# EAGLE schematic Reach_B0 (EAGLE 8.4.2)

## Sheet 1 of 5: A&B Stepper drivers
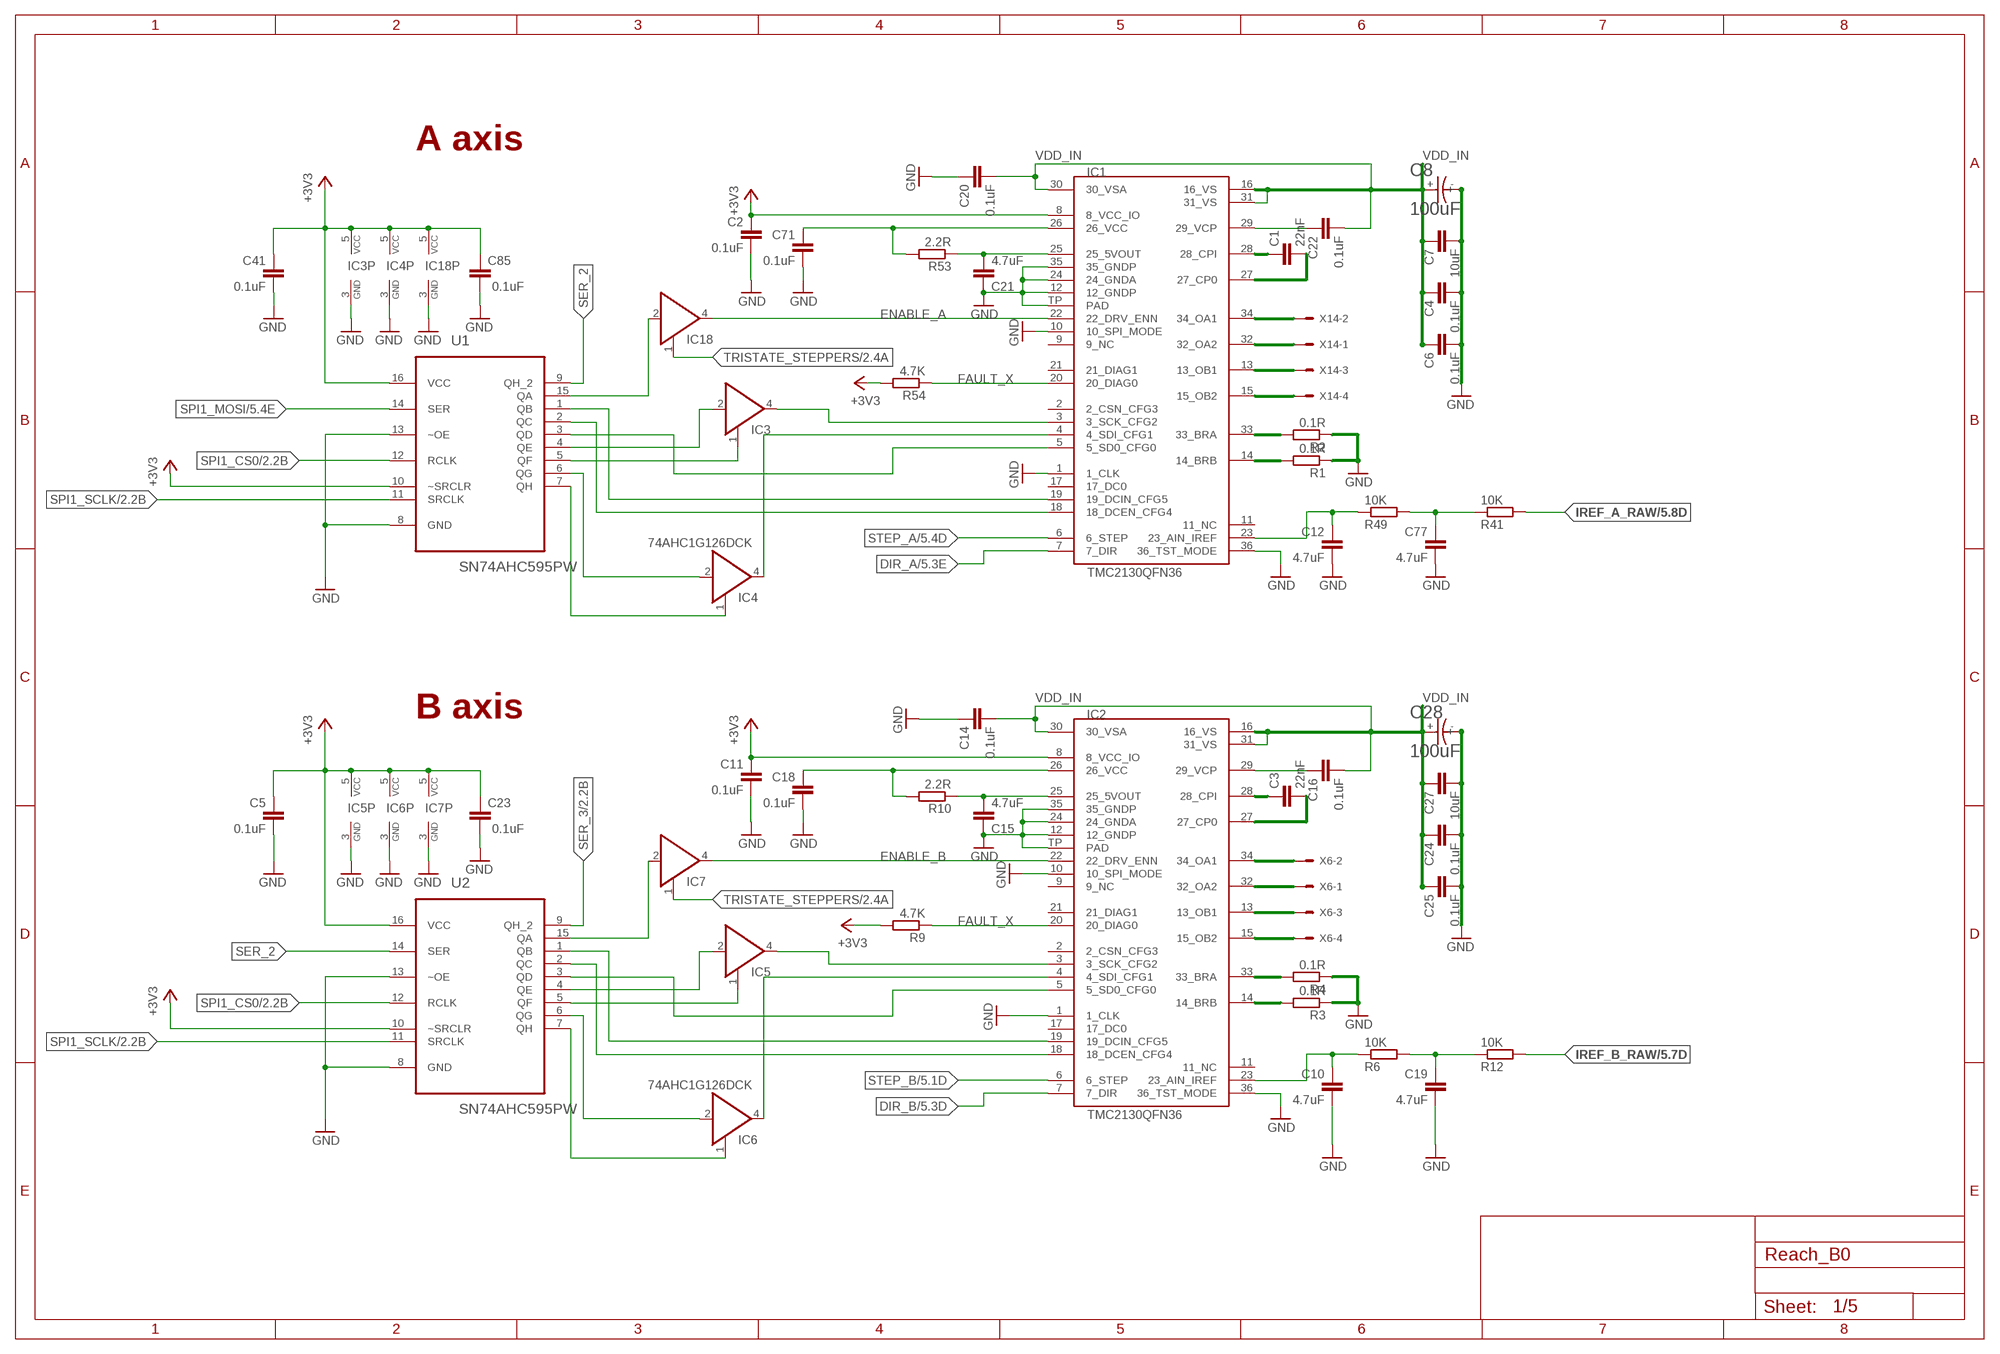
[diagram p0: schematic, sheet 1]

### Parts
C1  22nF  C-EUC0402  [C0402]
C2  0.1uF  C-EUC0402  [C0402]
C3  22nF  C-EUC0402  [C0402]
C4  0.1uF  C-EUC0402  [C0402]
C5  0.1uF  C-EUC0402  [C0402]
C6  0.1uF  C-EUC0402  [C0402]
C7  10uF  C-EUC0805  [C0805]
C8  100uF  C  [RHS1V10MCN1GS]
C10  4.7uF  C-EUC0402  [C0402]
C11  0.1uF  C-EUC0402  [C0402]
C12  4.7uF  C-EUC0402  [C0402]
C14  0.1uF  C-EUC0402  [C0402]
C15  4.7uF  C-EUC0402  [C0402]
C16  0.1uF  C-EUC0402  [C0402]
C18  0.1uF  C-EUC0402  [C0402]
C19  4.7uF  C-EUC0402  [C0402]
C20  0.1uF  C-EUC0402  [C0402]
C21  4.7uF  C-EUC0402  [C0402]
C22  0.1uF  C-EUC0402  [C0402]
C23  0.1uF  C-EUC0402  [C0402]
C24  0.1uF  C-EUC0402  [C0402]
C25  0.1uF  C-EUC0402  [C0402]
C27  10uF  C-EUC0805  [C0805]
C28  100uF  C  [RHS1V10MCN1GS]
C41  0.1uF  C-EUC0402  [C0402]
C71  0.1uF  C-EUC0402  [C0402]
C77  4.7uF  C-EUC0402  [C0402]
C85  0.1uF  C-EUC0402  [C0402]
IC1  TMC2130QFN36  [QFN36]
IC2  TMC2130QFN36  [QFN36]
IC3  74AHC1G126DCK  [SC70-5]
IC4  74AHC1G126DCK  [SC70-5]
IC5  74AHC1G126DCK  [SC70-5]
IC6  74AHC1G126DCK  [SC70-5]
IC7  74AHC1G126DCK  [SC70-5]
IC18  74AHC1G126DCK  [SC70-5]
R1  0.1R  R-EU_R0805  [R0805]
R2  0.1R  R-EU_R0805  [R0805]
R3  0.1R  R-EU_R0805  [R0805]
R4  0.1R  R-EU_R0805  [R0805]
R6  10K  R-EU_R0402  [R0402]
R9  4.7K  R-EU_R0402  [R0402]
R10  2.2R  R-EU_R0402  [R0402]
R12  10K  R-EU_R0402  [R0402]
R41  10K  R-EU_R0402  [R0402]
R49  10K  R-EU_R0402  [R0402]
R53  2.2R  R-EU_R0402  [R0402]
R54  4.7K  R-EU_R0402  [R0402]
U1  SN74AHC595PW  [SOP65P640X120-16N]
U2  SN74AHC595PW  [SOP65P640X120-16N]
X6  22-05-7048-04  [7395-04]
X14  22-05-7048-04  [7395-04]

### Nets
+3V3: C2.1 C5.1 C11.1 C23.1 C41.1 C85.1 IC1.8(8_VCC_IO) IC2.8(8_VCC_IO) IC3.5(VCC) IC4.5(VCC) IC5.5(VCC) IC6.5(VCC) IC7.5(VCC) IC18.5(VCC) R9.2 R54.2 U1.10(~SRCLR) U1.16(VCC) U2.10(~SRCLR) U2.16(VCC) ; also sheet 2,4,5
B_A3: IC2.34(34_OA1) X6.2
B_A4: IC2.32(32_OA2) X6.1
B_B3: IC2.15(15_OB2) X6.4
B_B4: IC2.13(13_OB1) X6.3
DIR_A: IC1.7(7_DIR) ; also sheet 5
DIR_B: IC2.7(7_DIR) ; also sheet 5
ENABLE_A: IC1.22(22_DRV_ENN) IC18.4(O)
ENABLE_B: IC2.22(22_DRV_ENN) IC7.4(O)
FAULT_X: IC1.20(20_DIAG0) IC2.20(20_DIAG0) R9.1 R54.1 ; also sheet 2,5
GND: C2.2 C4.2 C5.2 C6.2 C7.2 C8.- C10.2 C11.2 C12.2 C14.1 C15.1 C18.2 C19.2 C20.1 C21.1 C23.2 C24.2 C25.2 C27.2 C28.- C41.2 C71.2 C77.2 C85.2 IC1.1(1_CLK) IC1.10(10_SPI_MODE) IC1.12(12_GNDP) IC1.24(24_GNDA) IC1.35(35_GNDP) IC1.36(36_TST_MODE) IC1.TP(PAD) IC2.1(1_CLK) IC2.10(10_SPI_MODE) IC2.12(12_GNDP) IC2.24(24_GNDA) IC2.35(35_GNDP) IC2.36(36_TST_MODE) IC2.TP(PAD) IC3.3(GND) IC4.3(GND) IC5.3(GND) IC6.3(GND) IC7.3(GND) IC18.3(GND) R1.1 R2.1 R3.1 R4.1 U1.8(GND) U1.13(~OE) U2.8(GND) U2.13(~OE) ; also sheet 2,3,4,5
IREF_A: C77.1 R41.1 R49.2
IREF_A_RAW: R41.2 ; also sheet 5
IREF_B: C19.1 R6.2 R12.1
IREF_B_RAW: R12.2 ; also sheet 5
N$1: C3.2 IC2.27(27_CP0)
N$2: IC2.14(14_BRB) R3.2
N$3: IC2.33(33_BRA) R4.2
N$4: IC4.1(OE) U1.7(QH)
N$5: IC4.2(I) U1.6(QG)
N$6: IC1.18(18_DCEN_CFG4) U1.2(QC)
N$16: C1.1 IC1.28(28_CPI)
N$17: C1.2 IC1.27(27_CP0)
N$18: IC1.14(14_BRB) R1.2
N$19: IC1.33(33_BRA) R2.2
N$20: C12.1 IC1.23(23_AIN_IREF) R49.1
N$22: C10.1 IC2.23(23_AIN_IREF) R6.1
N$23: C3.1 IC2.28(28_CPI)
N$24: C15.2 IC2.25(25_5VOUT) R10.1
N$25: C16.1 IC2.29(29_VCP)
N$26: IC2.18(18_DCEN_CFG4) U2.2(QC)
N$27: IC2.19(19_DCIN_CFG5) U2.1(QB)
N$28: IC6.1(OE) U2.7(QH)
N$29: IC6.2(I) U2.6(QG)
N$30: IC5.2(I) U2.4(QE)
N$31: C21.2 IC1.25(25_5VOUT) R53.1
N$32: IC5.1(OE) U2.5(QF)
N$33: C22.1 IC1.29(29_VCP)
N$34: IC3.2(I) U1.4(QE)
N$35: IC2.5(5_SD0_CFG0) U2.3(QD)
N$36: C18.1 IC2.26(26_VCC) R10.2
N$37: IC7.2(I) U2.15(QA)
N$40: IC3.1(OE) U1.5(QF)
N$43: IC1.19(19_DCIN_CFG5) U1.1(QB)
N$44: IC1.5(5_SD0_CFG0) U1.3(QD)
N$108: C71.1 IC1.26(26_VCC) R53.2
N$120: IC18.2(I) U1.15(QA)
SER_2: U1.9(QH_2) U2.14(SER)
SER_3: U2.9(QH_2) ; also sheet 2
SPI1_CS0: U1.12(RCLK) U2.12(RCLK) ; also sheet 2,5
SPI1_MOSI: U1.14(SER) ; also sheet 5
SPI1_SCLK: U1.11(SRCLK) U2.11(SRCLK) ; also sheet 2,5
STEP_A: IC1.6(6_STEP) ; also sheet 5
STEP_B: IC2.6(6_STEP) ; also sheet 5
TRISTATE_STEPPERS: IC7.1(OE) IC18.1(OE) ; also sheet 2
VDD_IN: C4.1 C6.1 C7.1 C8.+ C14.2 C16.2 C20.2 C22.2 C24.1 C25.1 C27.1 C28.+ IC1.16(16_VS) IC1.30(30_VSA) IC1.31(31_VS) IC2.16(16_VS) IC2.30(30_VSA) IC2.31(31_VS) ; also sheet 2,3
X_A1: IC1.34(34_OA1) X14.2
X_A2: IC1.32(32_OA2) X14.1
X_B1: IC1.13(13_OB1) X14.3
X_B2: IC1.15(15_OB2) X14.4
X_CFG1: IC1.4(4_SDI_CFG1) IC4.4(O)
X_CFG2: IC1.3(3_SCK_CFG2) IC3.4(O)
X_CFG3: IC2.3(3_SCK_CFG2) IC5.4(O)
X_CFG4: IC2.4(4_SDI_CFG1) IC6.4(O)
Unconnected: IC1.2(2_CSN_CFG3) IC1.9(9_NC) IC1.11(11_NC) IC1.17(17_DC0) IC1.21(21_DIAG1) IC2.2(2_CSN_CFG3) IC2.9(9_NC) IC2.11(11_NC) IC2.17(17_DC0) IC2.21(21_DIAG1)

### Notes on the sheet
- A axis
- B axis

## Sheet 2 of 5: C Stepper driver
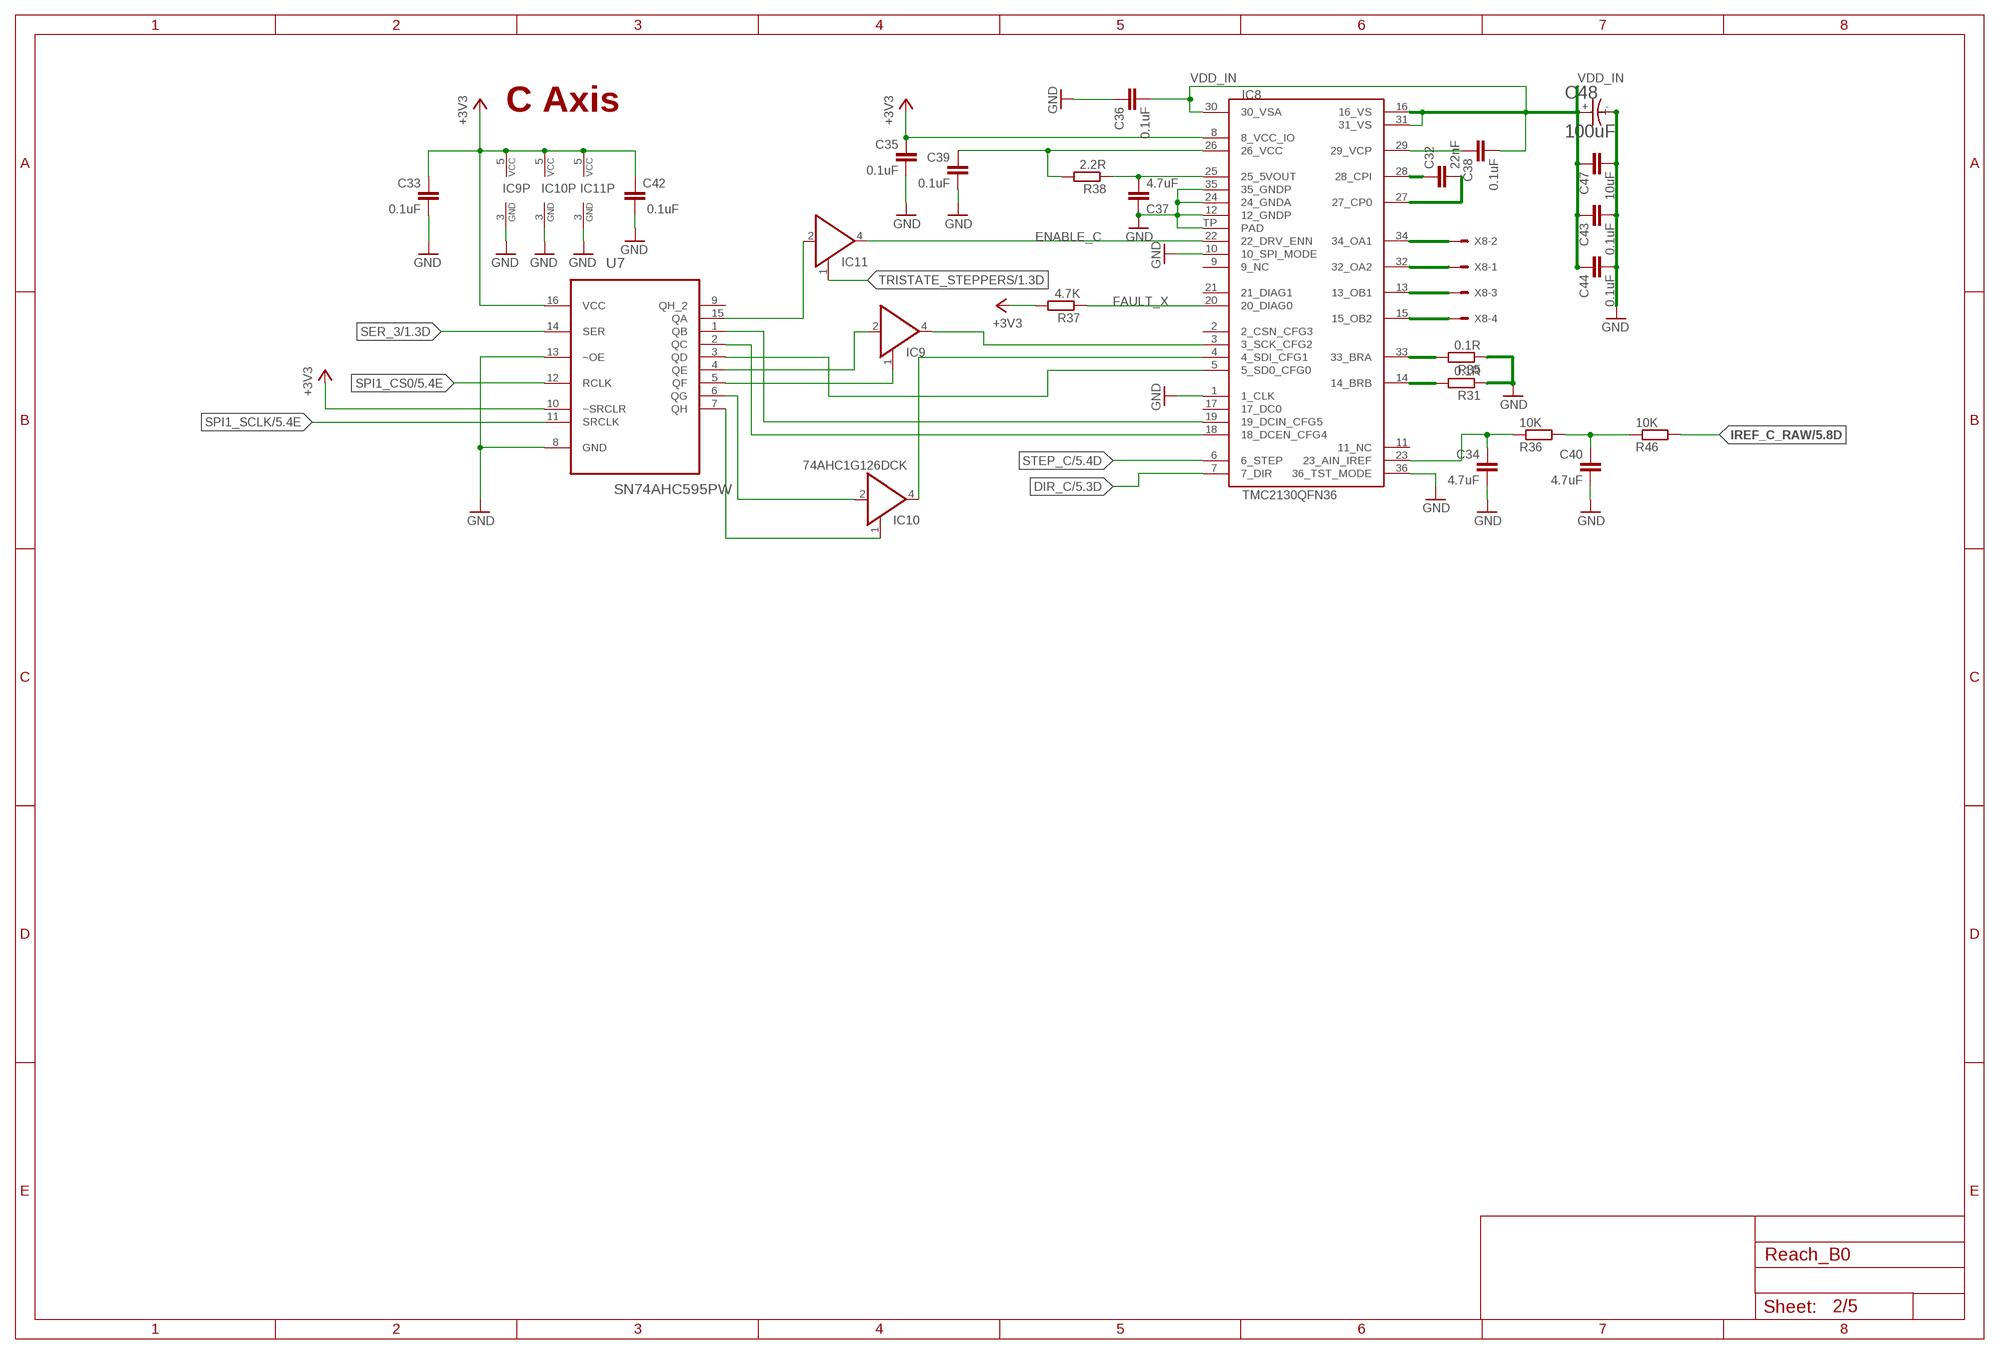
[diagram p1: schematic, sheet 2]

### Parts
C32  22nF  C-EUC0402  [C0402]
C33  0.1uF  C-EUC0402  [C0402]
C34  4.7uF  C-EUC0402  [C0402]
C35  0.1uF  C-EUC0402  [C0402]
C36  0.1uF  C-EUC0402  [C0402]
C37  4.7uF  C-EUC0402  [C0402]
C38  0.1uF  C-EUC0402  [C0402]
C39  0.1uF  C-EUC0402  [C0402]
C40  4.7uF  C-EUC0402  [C0402]
C42  0.1uF  C-EUC0402  [C0402]
C43  0.1uF  C-EUC0402  [C0402]
C44  0.1uF  C-EUC0402  [C0402]
C47  10uF  C-EUC0805  [C0805]
C48  100uF  C  [RHS1V10MCN1GS]
IC8  TMC2130QFN36  [QFN36]
IC9  74AHC1G126DCK  [SC70-5]
IC10  74AHC1G126DCK  [SC70-5]
IC11  74AHC1G126DCK  [SC70-5]
R31  0.1R  R-EU_R0805  [R0805]
R35  0.1R  R-EU_R0805  [R0805]
R36  10K  R-EU_R0402  [R0402]
R37  4.7K  R-EU_R0402  [R0402]
R38  2.2R  R-EU_R0402  [R0402]
R46  10K  R-EU_R0402  [R0402]
U7  SN74AHC595PW  [SOP65P640X120-16N]
X8  22-05-7048-04  [7395-04]

### Nets
+3V3: C33.1 C35.1 C42.1 IC8.8(8_VCC_IO) IC9.5(VCC) IC10.5(VCC) IC11.5(VCC) R37.2 U7.10(~SRCLR) U7.16(VCC) ; also sheet 1,4,5
C_A3: IC8.34(34_OA1) X8.2
C_A4: IC8.32(32_OA2) X8.1
C_B3: IC8.15(15_OB2) X8.4
C_B4: IC8.13(13_OB1) X8.3
DIR_C: IC8.7(7_DIR) ; also sheet 5
ENABLE_C: IC8.22(22_DRV_ENN) IC11.4(O)
FAULT_X: IC8.20(20_DIAG0) R37.1 ; also sheet 1,5
GND: C33.2 C34.2 C35.2 C36.1 C37.1 C39.2 C40.2 C42.2 C43.2 C44.2 C47.2 C48.- IC8.1(1_CLK) IC8.10(10_SPI_MODE) IC8.12(12_GNDP) IC8.24(24_GNDA) IC8.35(35_GNDP) IC8.36(36_TST_MODE) IC8.TP(PAD) IC9.3(GND) IC10.3(GND) IC11.3(GND) R31.1 R35.1 U7.8(GND) U7.13(~OE) ; also sheet 1,3,4,5
IREF_C: C40.1 R36.2 R46.1
IREF_C_RAW: R46.2 ; also sheet 5
N$52: C32.2 IC8.27(27_CP0)
N$54: IC8.14(14_BRB) R31.2
N$55: IC8.33(33_BRA) R35.2
N$56: C34.1 IC8.23(23_AIN_IREF) R36.1
N$57: C32.1 IC8.28(28_CPI)
N$58: C37.2 IC8.25(25_5VOUT) R38.1
N$59: C38.1 IC8.29(29_VCP)
N$60: IC8.18(18_DCEN_CFG4) U7.2(QC)
N$61: IC8.19(19_DCIN_CFG5) U7.1(QB)
N$62: IC10.1(OE) U7.7(QH)
N$63: IC10.2(I) U7.6(QG)
N$65: IC9.2(I) U7.4(QE)
N$66: IC9.1(OE) U7.5(QF)
N$67: IC8.5(5_SD0_CFG0) U7.3(QD)
N$68: C39.1 IC8.26(26_VCC) R38.2
N$69: IC11.2(I) U7.15(QA)
SER_3: U7.14(SER) ; also sheet 1
SPI1_CS0: U7.12(RCLK) ; also sheet 1,5
SPI1_SCLK: U7.11(SRCLK) ; also sheet 1,5
STEP_C: IC8.6(6_STEP) ; also sheet 5
TRISTATE_STEPPERS: IC11.1(OE) ; also sheet 1
VDD_IN: C36.2 C38.2 C43.1 C44.1 C47.1 C48.+ IC8.16(16_VS) IC8.30(30_VSA) IC8.31(31_VS) ; also sheet 1,3
X_CFG5: IC8.3(3_SCK_CFG2) IC9.4(O)
X_CFG6: IC8.4(4_SDI_CFG1) IC10.4(O)
Unconnected: IC8.2(2_CSN_CFG3) IC8.9(9_NC) IC8.11(11_NC) IC8.17(17_DC0) IC8.21(21_DIAG1) U7.9(QH_2)

### Notes on the sheet
- C Axis

## Sheet 3 of 5: Supply and power electronics
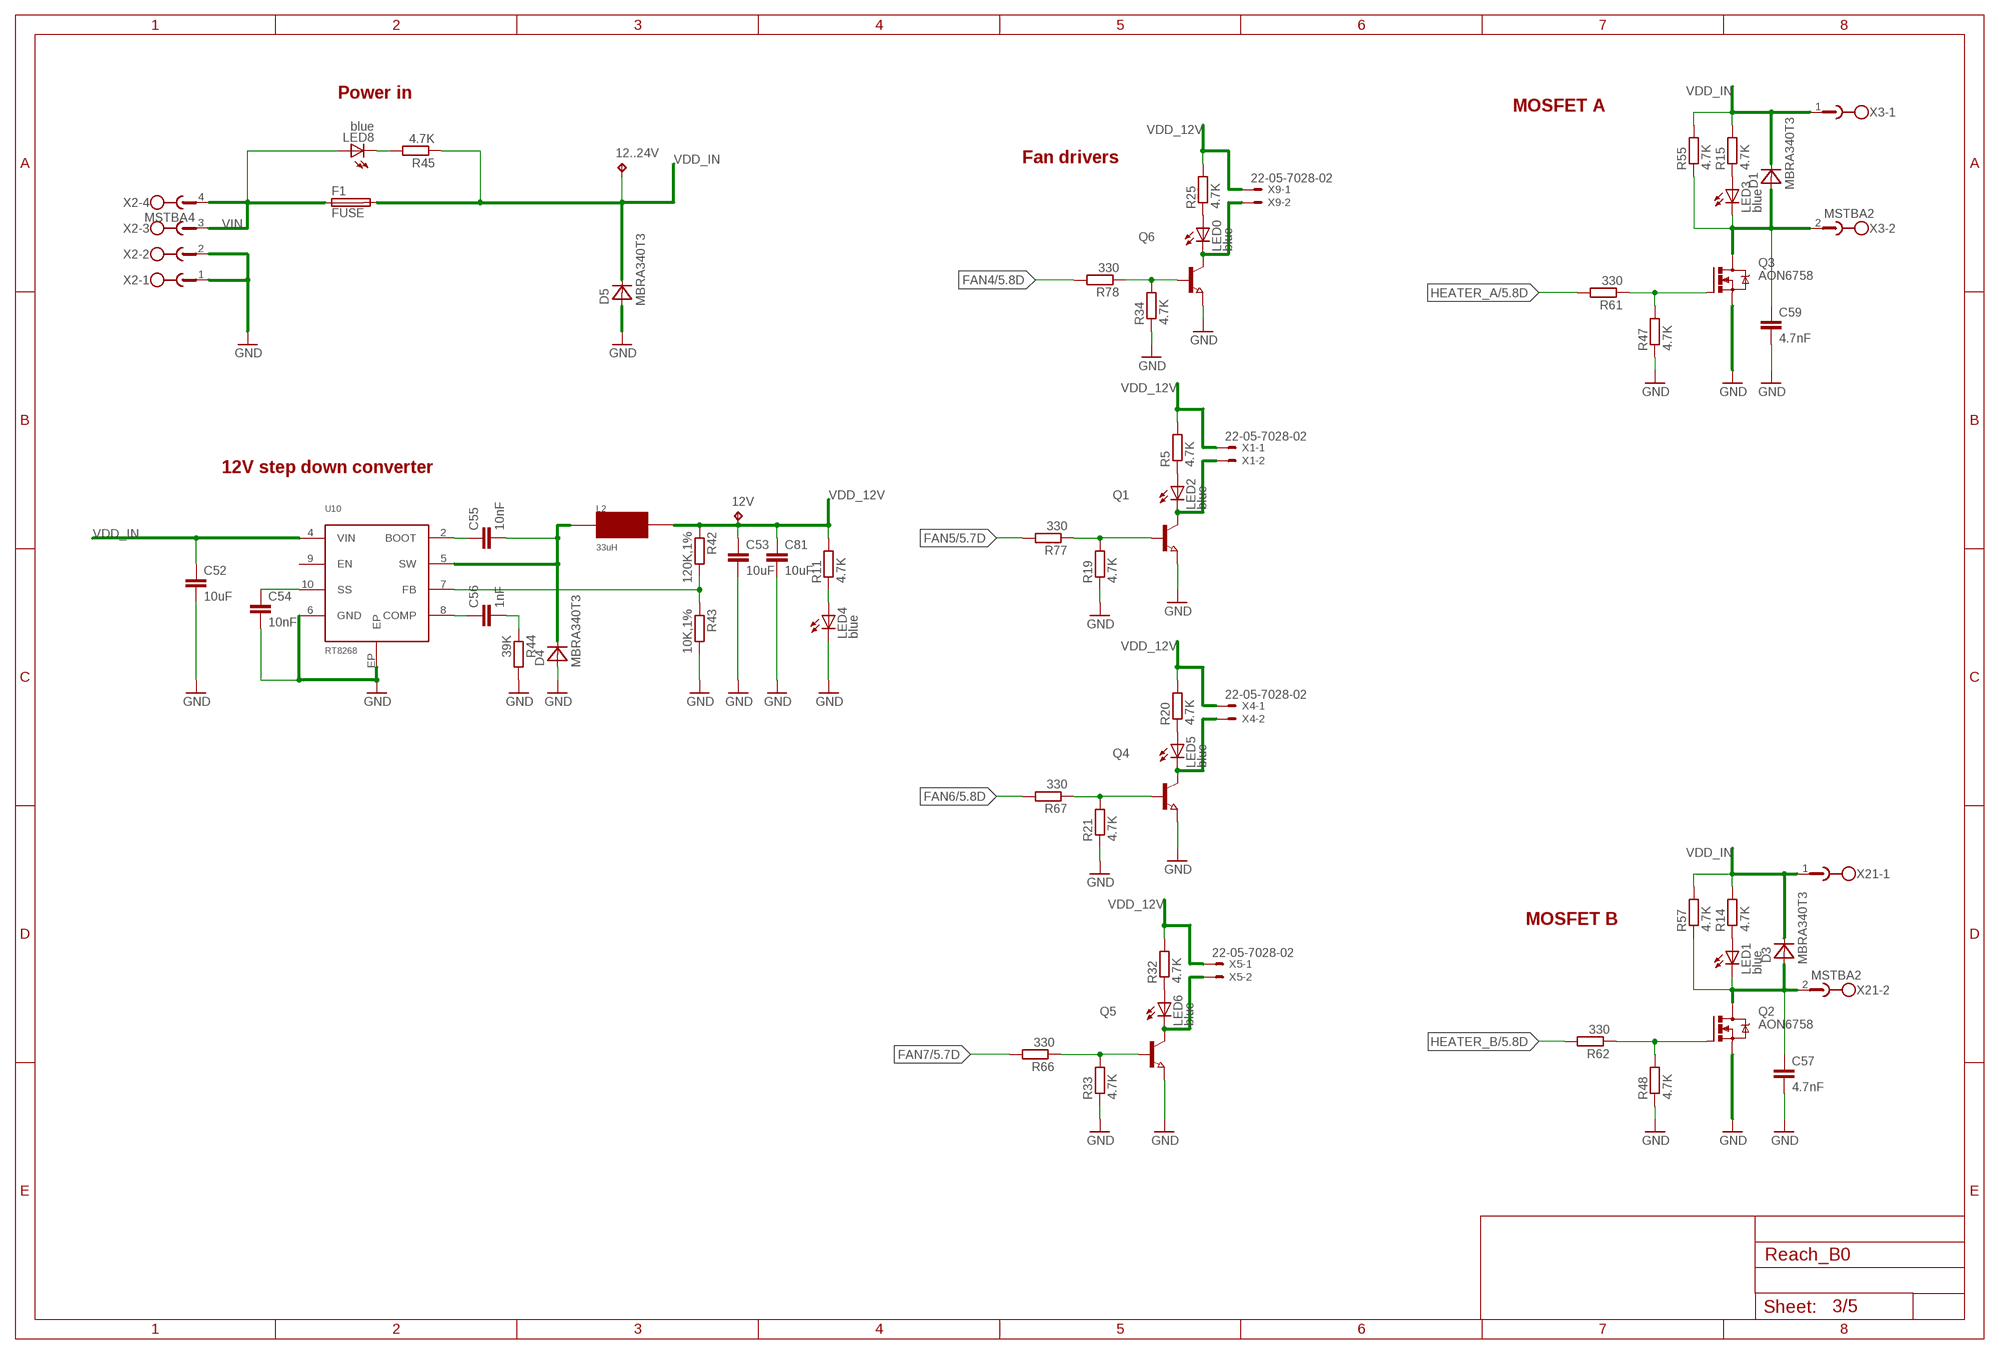
[diagram p2: schematic, sheet 3]

### Parts
12..24V  TPB1,27  [B1,27]
12V  TPB1,27  [B1,27]
C52  10uF  C-EUC1206  [C1206]
C53  10uF  C-EUC1206  [C1206]
C54  10nF  C-EUC0402  [C0402]
C55  10nF  C-EUC0402  [C0402]
C56  1nF  C-EUC0402  [C0402]
C57  4.7nF  C-EUC0402  [C0402]
C59  4.7nF  C-EUC0402  [C0402]
C81  10uF  C-EUC1206  [C1206]
D1  MBRA340T3  [SMA]
D3  MBRA340T3  [SMA]
D4  MBRA340T3  [SMA]
D5  MBRA340T3  [SMA]
F1  FUSE  [3557]
L2  33uH  RT8040T330  [NR8040T330]
LED0  blue  LEDCHIP-LED0603  [CHIP-LED0603]
LED1  blue  LEDCHIP-LED0603  [CHIP-LED0603]
LED2  blue  LEDCHIP-LED0603  [CHIP-LED0603]
LED3  blue  LEDCHIP-LED0603  [CHIP-LED0603]
LED4  blue  LEDCHIP-LED0603  [CHIP-LED0603]
LED5  blue  LEDCHIP-LED0603  [CHIP-LED0603]
LED6  blue  LEDCHIP-LED0603  [CHIP-LED0603]
LED8  blue  LEDCHIP-LED0603  [CHIP-LED0603]
Q1  NPN-TRANSISTOR_SOT23  [SOT23]
Q2  AON6758  [8-DFN-EP-(5X6)]
Q3  AON6758  [8-DFN-EP-(5X6)]
Q4  NPN-TRANSISTOR_SOT23  [SOT23]
Q5  NPN-TRANSISTOR_SOT23  [SOT23]
Q6  NPN-TRANSISTOR_SOT23  [SOT23]
R5  4.7K  R-EU_R0402  [R0402]
R11  4.7K  R-EU_R0402  [R0402]
R14  4.7K  R-EU_R0402  [R0402]
R15  4.7K  R-EU_R0402  [R0402]
R19  4.7K  R-EU_R0402  [R0402]
R20  4.7K  R-EU_R0402  [R0402]
R21  4.7K  R-EU_R0402  [R0402]
R25  4.7K  R-EU_R0402  [R0402]
R32  4.7K  R-EU_R0402  [R0402]
R33  4.7K  R-EU_R0402  [R0402]
R34  4.7K  R-EU_R0402  [R0402]
R42  120K,1%  R-EU_R0402  [R0402]
R43  10K,1%  R-EU_R0402  [R0402]
R44  39K  R-EU_R0402  [R0402]
R45  4.7K  R-EU_R0402  [R0402]
R47  4.7K  R-EU_R0402  [R0402]
R48  4.7K  R-EU_R0402  [R0402]
R55  4.7K  R-EU_R0402  [R0402]
R57  4.7K  R-EU_R0402  [R0402]
R61  330  R-EU_R0402  [R0402]
R62  330  R-EU_R0402  [R0402]
R66  330  R-EU_R0402  [R0402]
R67  330  R-EU_R0402  [R0402]
R77  330  R-EU_R0402  [R0402]
R78  330  R-EU_R0402  [R0402]
U10  RT8268  [MSOP10]
X1  22-05-7028-02  [7395-02]
X2  MSTBA4  [MSTBA4]
X3  MSTBA2  [MSTBA2]
X4  22-05-7028-02  [7395-02]
X5  22-05-7028-02  [7395-02]
X9  22-05-7028-02  [7395-02]
X21  MSTBA2  [MSTBA2]

### Nets
FAN4: R78.2 ; also sheet 5
FAN5: R77.2 ; also sheet 5
FAN6: R67.2 ; also sheet 5
FAN7: R66.2 ; also sheet 5
GND: C52.2 C53.2 C54.2 C57.2 C59.2 C81.2 D4.A D5.A LED4.C Q1.2(E) Q2.1(S) Q2.2(S) Q2.3(S) Q3.1(S) Q3.2(S) Q3.3(S) Q4.2(E) Q5.2(E) Q6.2(E) R19.1 R21.1 R33.1 R34.1 R43.2 R44.2 R47.1 R48.1 U10.6(GND) U10.EP X2.1 X2.2 ; also sheet 1,2,4,5
HEATER_A: R61.2 ; also sheet 5
HEATER_B: R62.2 ; also sheet 5
N$8: LED8.C R45.2
N$12: LED2.C Q1.3(C) X1.2
N$13: LED0.C Q6.3(C) X9.2
N$21: LED0.A R25.1
N$51: Q3.4(G) R47.2 R61.1
N$64: C57.1 D3.A LED1.C Q2.5(D) Q2.6(D) Q2.7(D) Q2.8(D) Q2.TH(D) R57.1 X21.2
N$73: Q2.4(G) R48.2 R62.1
N$76: Q5.1(B) R33.2 R66.1
N$77: Q4.1(B) R21.2 R67.1
N$78: LED2.A R5.1
N$79: LED5.C Q4.3(C) X4.2
N$80: LED5.A R20.1
N$81: LED6.C Q5.3(C) X5.2
N$82: LED6.A R32.1
N$83: Q1.1(B) R19.2 R77.1
N$84: Q6.1(B) R34.2 R78.1
N$96: LED4.A R11.1
N$127: LED3.A R15.1
N$129: LED1.A R14.1
N$233: R42.2 R43.1 U10.7(FB)
N$234: C59.1 D1.A LED3.C Q3.5(D) Q3.6(D) Q3.7(D) Q3.8(D) Q3.TH(D) R55.1 X3.2
N$238: C55.2 D4.C L2.P$2 U10.5(SW)
N$243: C54.1 U10.10(SS)
N$244: C56.1 U10.8(COMP)
N$245: C55.1 U10.2(BOOT)
N$246: C56.2 R44.1
VDD_12V: 12V.TP C53.1 C81.1 L2.P$1 R5.2 R11.2 R20.2 R25.2 R32.2 R42.1 X1.1 X4.1 X5.1 X9.1
VDD_IN: 12..24V.TP C52.1 D1.C D3.C D5.C F1.P$3 F1.P$4 R14.2 R15.2 R45.1 R55.2 R57.2 U10.4(VIN) X3.1 X21.1 ; also sheet 1,2
VIN: F1.P$1 F1.P$2 LED8.A X2.3 X2.4
Unconnected: U10.9(EN)

### Notes on the sheet
- Power in
- MOSFET A
- Fan drivers
- 12V step down converter
- MOSFET B

## Sheet 4 of 5: Sensors (temp)
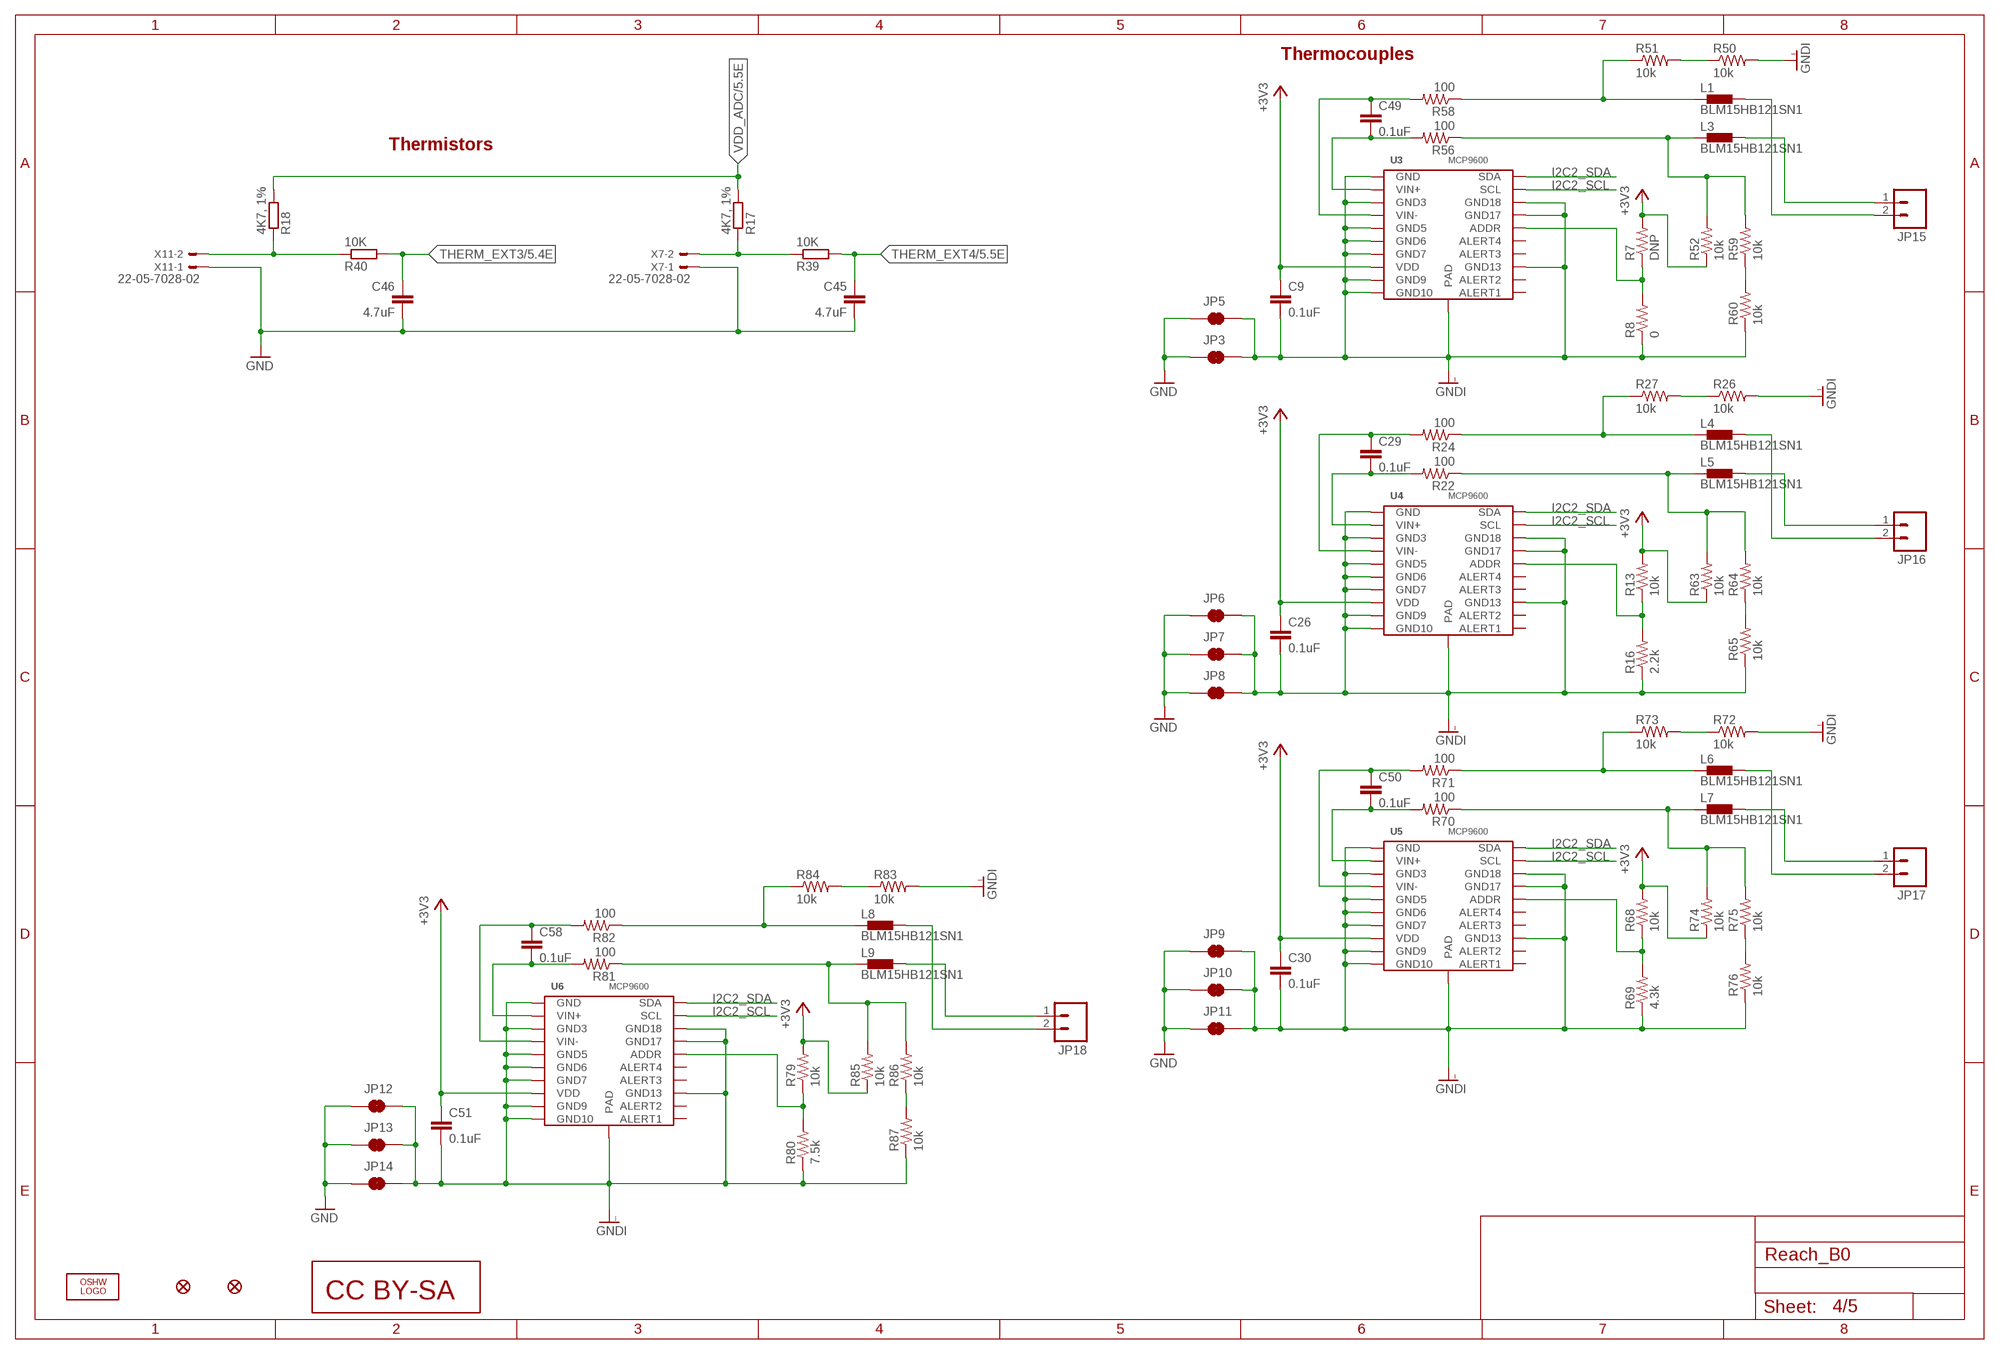
[diagram p3: schematic, sheet 4]

### Parts
C9  0.1uF  C-EUC0402  [C0402]
C26  0.1uF  C-EUC0402  [C0402]
C29  0.1uF  C-EUC0402  [C0402]
C30  0.1uF  C-EUC0402  [C0402]
C45  4.7uF  C-EUC0402  [C0402]
C46  4.7uF  C-EUC0402  [C0402]
C49  0.1uF  C-EUC0402  [C0402]
C50  0.1uF  C-EUC0402  [C0402]
C51  0.1uF  C-EUC0402  [C0402]
C58  0.1uF  C-EUC0402  [C0402]
JP1  FIDUCIAL1X2.5  [FIDUCIAL-1X2.5]
JP2  FIDUCIAL1X2.5  [FIDUCIAL-1X2.5]
JP3  JUMPER-PAD-2-NC_BY_TRACE  [PAD-JUMPER-2-NC_BY_TRACE_YES_SILK]
JP5  JUMPER-PAD-2-NC_BY_TRACE  [PAD-JUMPER-2-NC_BY_TRACE_YES_SILK]
JP6  JUMPER-PAD-2-NC_BY_TRACE  [PAD-JUMPER-2-NC_BY_TRACE_YES_SILK]
JP7  JUMPER-PAD-2-NC_BY_TRACE  [PAD-JUMPER-2-NC_BY_TRACE_YES_SILK]
JP8  JUMPER-PAD-2-NC_BY_TRACE  [PAD-JUMPER-2-NC_BY_TRACE_YES_SILK]
JP9  JUMPER-PAD-2-NC_BY_TRACE  [PAD-JUMPER-2-NC_BY_TRACE_YES_SILK]
JP10  JUMPER-PAD-2-NC_BY_TRACE  [PAD-JUMPER-2-NC_BY_TRACE_YES_SILK]
JP11  JUMPER-PAD-2-NC_BY_TRACE  [PAD-JUMPER-2-NC_BY_TRACE_YES_SILK]
JP12  JUMPER-PAD-2-NC_BY_TRACE  [PAD-JUMPER-2-NC_BY_TRACE_YES_SILK]
JP13  JUMPER-PAD-2-NC_BY_TRACE  [PAD-JUMPER-2-NC_BY_TRACE_YES_SILK]
JP14  JUMPER-PAD-2-NC_BY_TRACE  [PAD-JUMPER-2-NC_BY_TRACE_YES_SILK]
JP15  M025MM  [SCREWTERMINAL-5MM-2]
JP16  M025MM  [SCREWTERMINAL-5MM-2]
JP17  M025MM  [SCREWTERMINAL-5MM-2]
JP18  M025MM  [SCREWTERMINAL-5MM-2]
L1  BLM15HB121SN1  [0402]
L3  BLM15HB121SN1  [0402]
L4  BLM15HB121SN1  [0402]
L5  BLM15HB121SN1  [0402]
L6  BLM15HB121SN1  [0402]
L7  BLM15HB121SN1  [0402]
L8  BLM15HB121SN1  [0402]
L9  BLM15HB121SN1  [0402]
LOGO1  OSHW_LOGO_FILLX0200-NT  [OSHW_FILLX200_NOTEXT]
R7  DNP  RESISTOR0402-RES  [0402-RES]
R8  0  RESISTOR0402-RES  [0402-RES]
R13  10k  RESISTOR0402-RES  [0402-RES]
R16  2.2k  RESISTOR0402-RES  [0402-RES]
R17  4K7, 1%  R-EU_R0402  [R0402]
R18  4K7, 1%  R-EU_R0402  [R0402]
R22  100  RESISTOR0402-RES  [0402-RES]
R24  100  RESISTOR0402-RES  [0402-RES]
R26  10k  RESISTOR0805-RES  [0805]
R27  10k  RESISTOR0805-RES  [0805]
R39  10K  R-EU_R0402  [R0402]
R40  10K  R-EU_R0402  [R0402]
R50  10k  RESISTOR0805-RES  [0805]
R51  10k  RESISTOR0805-RES  [0805]
R52  10k  RESISTOR0805-RES  [0805]
R56  100  RESISTOR0402-RES  [0402-RES]
R58  100  RESISTOR0402-RES  [0402-RES]
R59  10k  RESISTOR0805-RES  [0805]
R60  10k  RESISTOR0805-RES  [0805]
R63  10k  RESISTOR0805-RES  [0805]
R64  10k  RESISTOR0805-RES  [0805]
R65  10k  RESISTOR0805-RES  [0805]
R68  10k  RESISTOR0402-RES  [0402-RES]
R69  4.3k  RESISTOR0402-RES  [0402-RES]
R70  100  RESISTOR0402-RES  [0402-RES]
R71  100  RESISTOR0402-RES  [0402-RES]
R72  10k  RESISTOR0805-RES  [0805]
R73  10k  RESISTOR0805-RES  [0805]
R74  10k  RESISTOR0805-RES  [0805]
R75  10k  RESISTOR0805-RES  [0805]
R76  10k  RESISTOR0805-RES  [0805]
R79  10k  RESISTOR0402-RES  [0402-RES]
R80  7.5k  RESISTOR0402-RES  [0402-RES]
R81  100  RESISTOR0402-RES  [0402-RES]
R82  100  RESISTOR0402-RES  [0402-RES]
R83  10k  RESISTOR0805-RES  [0805]
R84  10k  RESISTOR0805-RES  [0805]
R85  10k  RESISTOR0805-RES  [0805]
R86  10k  RESISTOR0805-RES  [0805]
R87  10k  RESISTOR0805-RES  [0805]
U3  MCP9600  [MQFN-20]
U4  MCP9600  [MQFN-20]
U5  MCP9600  [MQFN-20]
U6  MCP9600  [MQFN-20]
U$4  CC-BY-SA  [CC-BY-SA]
X7  22-05-7028-02  [7395-02]
X11  22-05-7028-02  [7395-02]

### Nets
+3V3: C9.1 C26.1 C30.1 C51.1 R7.2 R13.2 R52.1 R63.1 R68.2 R74.1 R79.2 R85.1 U3.P$8(VDD) U4.P$8(VDD) U5.P$8(VDD) U6.P$8(VDD) ; also sheet 1,2,5
GND: C45.2 C46.2 JP3.1 JP5.1 JP6.1 JP7.1 JP8.1 JP9.1 JP10.1 JP11.1 JP12.1 JP13.1 JP14.1 X7.1 X11.1 ; also sheet 1,2,3,5
GNDI: C9.2 C26.2 C30.2 C51.2 JP3.2 JP5.2 JP6.2 JP7.2 JP8.2 JP9.2 JP10.2 JP11.2 JP12.2 JP13.2 JP14.2 R8.1 R16.1 R26.2 R50.2 R60.1 R65.1 R69.1 R72.2 R76.1 R80.1 R83.2 R87.1 U3.P$1(GND) U3.P$3(GND3) U3.P$5(GND5) U3.P$6(GND6) U3.P$7(GND7) U3.P$9(GND9) U3.P$10(GND10) U3.P$13(GND13) U3.P$17(GND17) U3.P$18(GND18) U3.P$21(PAD) U4.P$1(GND) U4.P$3(GND3) U4.P$5(GND5) U4.P$6(GND6) U4.P$7(GND7) U4.P$9(GND9) U4.P$10(GND10) U4.P$13(GND13) U4.P$17(GND17) U4.P$18(GND18) U4.P$21(PAD) U5.P$1(GND) U5.P$3(GND3) U5.P$5(GND5) U5.P$6(GND6) U5.P$7(GND7) U5.P$9(GND9) U5.P$10(GND10) U5.P$13(GND13) U5.P$17(GND17) U5.P$18(GND18) U5.P$21(PAD) U6.P$1(GND) U6.P$3(GND3) U6.P$5(GND5) U6.P$6(GND6) U6.P$7(GND7) U6.P$9(GND9) U6.P$10(GND10) U6.P$13(GND13) U6.P$17(GND17) U6.P$18(GND18) U6.P$21(PAD)
I2C2_SCL: U3.P$19(SCL) U4.P$19(SCL) U5.P$19(SCL) U6.P$19(SCL) ; also sheet 5
I2C2_SDA: U3.P$20(SDA) U4.P$20(SDA) U5.P$20(SDA) U6.P$20(SDA) ; also sheet 5
N$9: R50.1 R51.2
N$11: L3.1 R52.2 R56.1 R59.2
N$14: JP15.1 L3.2
N$15: JP15.2 L1.2
N$38: JP16.2 L4.2
N$39: R7.1 R8.2 U3.P$16(ADDR)
N$41: R13.1 R16.2 U4.P$16(ADDR)
N$42: L5.1 R22.1 R63.2 R64.2
N$45: C29.2 R22.2 U4.P$2(VIN+)
N$46: C29.1 R24.2 U4.P$4(VIN-)
N$47: JP16.1 L5.2
N$48: L4.1 R24.1 R27.1
N$49: R26.1 R27.2
N$50: R64.1 R65.2
N$70: C49.2 R56.2 U3.P$2(VIN+)
N$71: C49.1 R58.2 U3.P$4(VIN-)
N$72: L1.1 R51.1 R58.1
N$75: R59.1 R60.2
N$87: JP17.2 L6.2
N$88: R68.1 R69.2 U5.P$16(ADDR)
N$89: L7.1 R70.1 R74.2 R75.2
N$90: C50.2 R70.2 U5.P$2(VIN+)
N$91: C50.1 R71.2 U5.P$4(VIN-)
N$92: JP17.1 L7.2
N$93: L6.1 R71.1 R73.1
N$94: R72.1 R73.2
N$95: R75.1 R76.2
N$123: JP18.2 L8.2
N$124: R79.1 R80.2 U6.P$16(ADDR)
N$125: L9.1 R81.1 R85.2 R86.2
N$126: C58.2 R81.2 U6.P$2(VIN+)
N$128: C58.1 R82.2 U6.P$4(VIN-)
N$130: JP18.1 L9.2
N$131: L8.1 R82.1 R84.1
N$132: R83.1 R84.2
N$133: R86.1 R87.2
N$240: R18.1 R40.1 X11.2
N$241: R17.1 R39.1 X7.2
THERM_EXT3: C46.1 R40.2 ; also sheet 5
THERM_EXT4: C45.1 R39.2 ; also sheet 5
VDD_ADC: R17.2 R18.2 ; also sheet 5
Unconnected: U3.P$11(ALERT1) U3.P$12(ALERT2) U3.P$14(ALERT3) U3.P$15(ALERT4) U4.P$11(ALERT1) U4.P$12(ALERT2) U4.P$14(ALERT3) U4.P$15(ALERT4) U5.P$11(ALERT1) U5.P$12(ALERT2) U5.P$14(ALERT3) U5.P$15(ALERT4) U6.P$11(ALERT1) U6.P$12(ALERT2) U6.P$14(ALERT3) U6.P$15(ALERT4)

### Notes on the sheet
- Thermocouples
- Thermistors

## Sheet 5 of 5: Connectors
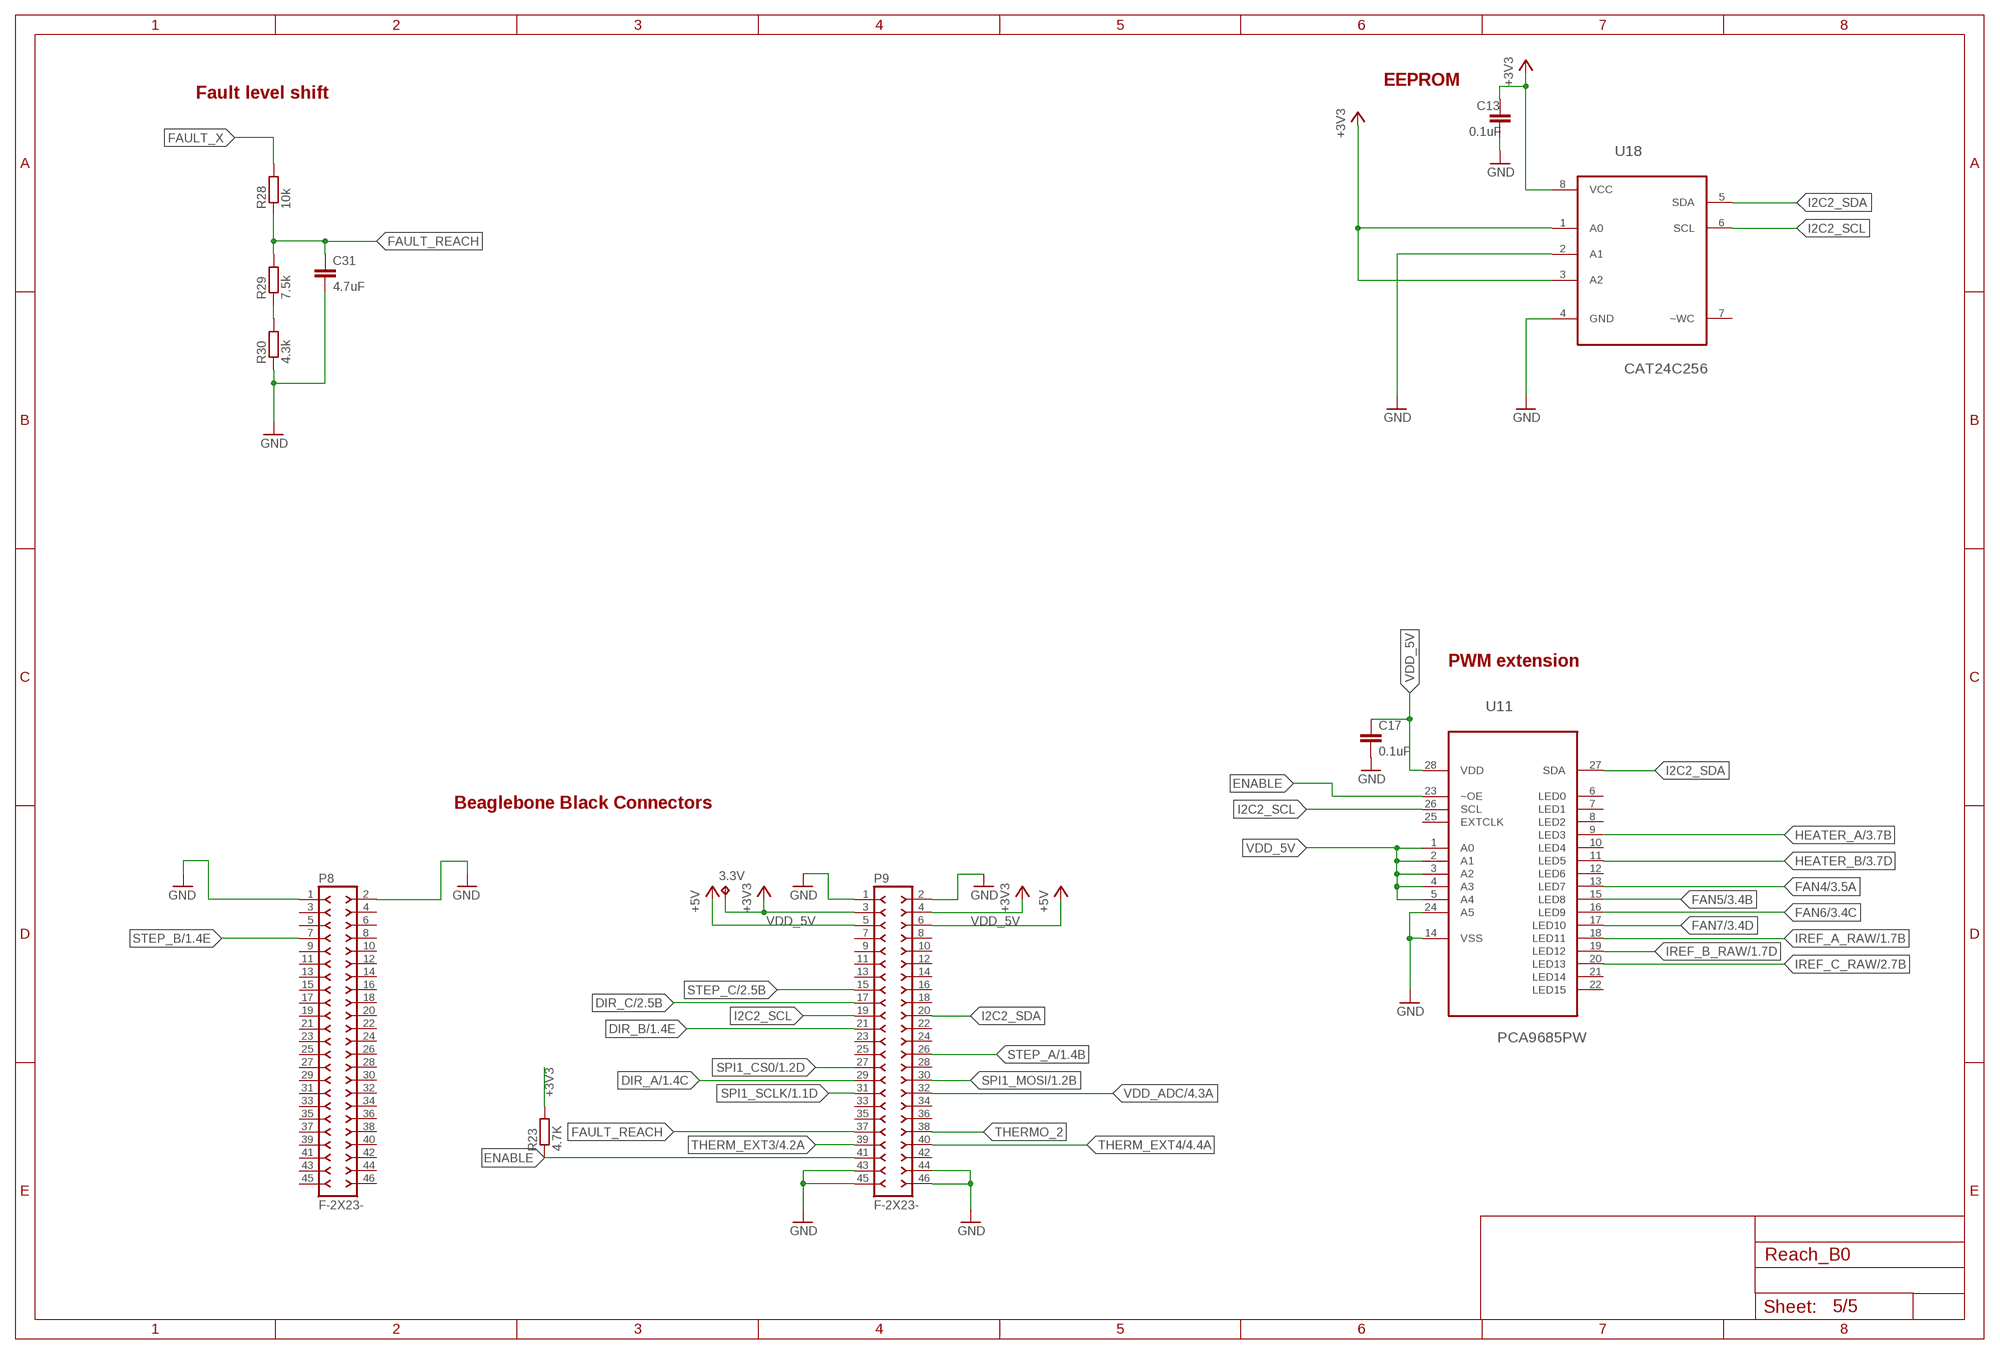
[diagram p4: schematic, sheet 5]

### Parts
3.3V  TPB1,27  [B1,27]
C13  0.1uF  C-EUC0402  [C0402]
C17  0.1uF  C-EUC0402  [C0402]
C31  4.7uF  C-EUC0402  [C0402]
P8  F-2X23-  [DIL-100-2X23]
P9  F-2X23-  [DIL-100-2X23]
R23  4.7K  R-EU_R0402  [R0402]
R28  10k  R-EU_R0402  [R0402]
R29  7.5k  R-EU_R0402  [R0402]
R30  4.3k  R-EU_R0402  [R0402]
U11  PCA9685PW  [SOP65P640X110-28N]
U18  CAT24C256  [SOIC127P600X175-8N]

### Nets
+3V3: 3.3V.TP C13.1 P9.3 P9.4 R23.2 U18.1(A0) U18.3(A2) U18.8(VCC) ; also sheet 1,2,4
DIR_A: P9.29 ; also sheet 1
DIR_B: P9.21 ; also sheet 1
DIR_C: P9.17 ; also sheet 2
ENABLE: P9.41 R23.1 U11.23(~OE)
FAN4: U11.13(LED7) ; also sheet 3
FAN5: U11.15(LED8) ; also sheet 3
FAN6: U11.16(LED9) ; also sheet 3
FAN7: U11.17(LED10) ; also sheet 3
FAULT_REACH: C31.1 P9.37 R28.1 R29.2
FAULT_X: R28.2 ; also sheet 1,2
GND: C13.2 C17.2 C31.2 P8.1 P8.2 P9.1 P9.2 P9.43 P9.44 P9.45 P9.46 R30.1 U11.14(VSS) U11.24(A5) U18.2(A1) U18.4(GND) ; also sheet 1,2,3,4
HEATER_A: U11.9(LED3) ; also sheet 3
HEATER_B: U11.11(LED5) ; also sheet 3
I2C2_SCL: P9.19 U11.26(SCL) U18.6(SCL) ; also sheet 4
I2C2_SDA: P9.20 U11.27(SDA) U18.5(SDA) ; also sheet 4
IREF_A_RAW: U11.18(LED11) ; also sheet 1
IREF_B_RAW: U11.19(LED12) ; also sheet 1
IREF_C_RAW: U11.20(LED13) ; also sheet 2
N$53: R29.1 R30.2
SPI1_CS0: P9.27 ; also sheet 1,2
SPI1_MOSI: P9.30 ; also sheet 1
SPI1_SCLK: P9.31 ; also sheet 1,2
STEP_A: P9.26 ; also sheet 1
STEP_B: P8.7 ; also sheet 1
STEP_C: P9.15 ; also sheet 2
THERM_EXT3: P9.39 ; also sheet 4
THERM_EXT4: P9.40 ; also sheet 4
THERMO_2: P9.38
VDD_5V: C17.1 P9.5 P9.6 U11.1(A0) U11.2(A1) U11.3(A2) U11.4(A3) U11.5(A4) U11.28(VDD) ; supply symbol labelled +5V
VDD_ADC: P9.32 ; also sheet 4
Unconnected: P8.3 P8.4 P8.5 P8.6 P8.8 P8.9 P8.10 P8.11 P8.12 P8.13 P8.14 P8.15 P8.16 P8.17 P8.18 P8.19 P8.20 P8.21 P8.22 P8.23 P8.24 P8.25 P8.26 P8.27 P8.28 P8.29 P8.30 P8.31 P8.32 P8.33 P8.34 P8.35 P8.36 P8.37 P8.38 P8.39 P8.40 P8.41 P8.42 P8.43 P8.44 P8.45 P8.46 P9.7 P9.8 P9.9 P9.10 P9.11 P9.12 P9.13 P9.14 P9.16 P9.18 P9.22 P9.23 P9.24 P9.25 P9.28 P9.33 P9.34 P9.35 P9.36 P9.42 U11.6(LED0) U11.7(LED1) U11.8(LED2) U11.10(LED4) U11.12(LED6) U11.21(LED14) U11.22(LED15) U11.25(EXTCLK) U18.7(~WC)

### Notes on the sheet
- EEPROM
- Fault level shift
- PWM extension
- Beaglebone Black Connectors

## Library data of the parts
3.3V 12..24V 12V = testpad:TP: Test pad
C1-C3 C5 C9-C23 C26 C29-C42 C49-C51 C57-C59 C71 C77 C85 = rcl:C-EU: CAPACITOR, European symbol
C4 C6 C24 C25 C43 C44 = rcl:C-EU: CAPACITOR, European symbol; MPN: CL10B104KB8NNND
C7 C27 C47 = rcl:C-EU: CAPACITOR, European symbol; MPN: C2012X5R1V106M085AC
C8 C28 C48 = Panasonic-EEEFK_EEEFP:C; MPN: RHS1V101MCN1GS
C45 C46 = rcl:C-EU: CAPACITOR, European symbol; MPN: GRM155R60J475ME47D
C52 C53 C81 = rcl:C-EU: CAPACITOR, European symbol; MPN: CL31B106KAHNNNE
C54 C55 = rcl:C-EU: CAPACITOR, European symbol; MPN: CL05B103KB5NNNC
C56 = rcl:C-EU: CAPACITOR, European symbol; MPN: C1005X7R1H102K050BA
D1 D3 D5 = diode:MBRA340T3: Surface Mount Schottky Power Rectifier Source: http://www.onsemi.com/pub_link/Collateral/MBRA340T3-D.PDF
D4 = diode:MBRA340T3: Surface Mount Schottky Power Rectifier Source: http://www.onsemi.com/pub_link/Collateral/MBRA340T3-D.PDF; MPN: MBRA340T3G
F1 = fuse:FUSE: Fuse
IC1 IC2 IC8 = reach_custom:TMC2130
IC3-IC7 IC9-IC11 IC18 = 74xx-little-de:74*1G126: Single Bus Buffer Gate With 3-State Outputs
JP1 JP2 = SparkFun:FIDUCIAL: Fiducial Alignment Points Various fiducial points for machine vision alignment.
JP3 JP5-JP14 = SparkFun-PassivesNEW:JUMPER-PAD-2-NC_BY_TRACE
JP15-JP18 = SparkFun-ConnectorsNEW:M02: Standard 2-pin 0.1" header. Use with - straight break away headers ( PRT-00116) - right angle break away headers (PRT-00553) - swiss pins (PRT-00743) - machine pins (PRT-00117) - female headers (PRT-00115) Molex polarized connector foot print use with: PRT-08233 with associated crimp pins and housings. 2.54_SCREWTERM for use with PRT-10571. 3.5mm Screw Terminal footprints for PRT-08084 5mm Screw Terminal footprints for use with PRT-08432; STOREFRONT_ID: PRT-08432
L1 L3-L9 = inductors:BLM15H: EMIFIL (R) Chip Ferrite Bead for GHz Noise Source: http://www.murata.com/ Ferrite Bead BLM15H.pdf
L2 = SparkFun:RT8040T330; MPN: NR8040T330M
LED0 LED2 LED4-LED6 = led:LED: LED OSRAM: - CHIPLED LG R971, LG N971, LY N971, LG Q971, LY Q971, LO R971, LY R971 LH N974, LH R974 LS Q976, LO Q976, LY Q976 LO Q996 - Hyper CHIPLED LW Q18S LB Q993, LB Q99A, LB R99A - SideLED LS A670, LO A670, LY A670, LG A670, LP A670 LB A673, LV A673, LT A673, LW A673 LH A674 LY A675 LS A676, LA A676, LO A676, LY A676, LW A676 LS A679, LY A679, LG A679 - Hyper Micro SIDELED® LS Y876, LA Y876, LO Y876, LY Y876 LT Y87S - SmartLED LW L88C, LW L88S LB L89C, LB L89S, LG L890 LS L89K, LO L89K, LY L89K LS L896, LA L896, LO L896, LY L896 - TOPLED LS T670, LO T670, LY T670, LG T670, LP T670 LSG T670, LSP T670, LSY T670, LOP T670, LYG T670 LG T671, LOG T671, LSG T671 LB T673, LV T673, LT T673, LW T673 LH T674 LS T676, LA T676, LO T676, LY T676, LB T676, LH T676, LSB T676, LW T676 LB T67C, LV T67C, LT T67C, LS T67K, LO T67K, LY T67K, LW E67C LS E67B, LA E67B, LO E67B, LY E67B, LB E67C, LV E67C, LT E67C LW T67C LS T679, LY T679, LG T679 LS T770, LO T770, LY T770, LG T770, LP T770 LB T773, LV T773, LT T773, LW T773 LH T774 LS E675, LA E675, LY E675, LS T675 LS T776, LA T776, LO T776, LY T776, LB T776 LHGB T686 LT T68C, LB T68C - Hyper Mini TOPLED® LB M676 - Mini TOPLED Santana® LG M470 LS M47K, LO M47K, LY M47K Source: http://www.osram.convergy.de LUXEON: - LUMILED® LXK2-PW12-R00, LXK2-PW12-S00, LXK2-PW14-U00, LXK2-PW14-V00 LXK2-PM12-R00, LXK2-PM12-S00, LXK2-PM14-U00 LXK2-PE12-Q00, LXK2-PE12-R00, LXK2-PE12-S00, LXK2-PE14-T00, LXK2-PE14-U00 LXK2-PB12-K00, LXK2-PB12-L00, LXK2-PB12-M00, LXK2-PB14-N00, LXK2-PB14-P00, LXK2-PB14-Q00 LXK2-PR12-L00, LXK2-PR12-M00, LXK2-PR14-Q00, LXK2-PR14-R00 LXK2-PD12-Q00, LXK2-PD12-R00, LXK2-PD12-S00 LXK2-PH12-R00, LXK2-PH12-S00 LXK2-PL12-P00, LXK2-PL12-Q00, LXK2-PL12-R00 Source: www.luxeon.com KINGBRIGHT: KA-3528ASYC Source: www.kingbright.com; MPN: Q65110A7211
LED1 LED3 LED8 = led:LED: LED OSRAM: - CHIPLED LG R971, LG N971, LY N971, LG Q971, LY Q971, LO R971, LY R971 LH N974, LH R974 LS Q976, LO Q976, LY Q976 LO Q996 - Hyper CHIPLED LW Q18S LB Q993, LB Q99A, LB R99A - SideLED LS A670, LO A670, LY A670, LG A670, LP A670 LB A673, LV A673, LT A673, LW A673 LH A674 LY A675 LS A676, LA A676, LO A676, LY A676, LW A676 LS A679, LY A679, LG A679 - Hyper Micro SIDELED® LS Y876, LA Y876, LO Y876, LY Y876 LT Y87S - SmartLED LW L88C, LW L88S LB L89C, LB L89S, LG L890 LS L89K, LO L89K, LY L89K LS L896, LA L896, LO L896, LY L896 - TOPLED LS T670, LO T670, LY T670, LG T670, LP T670 LSG T670, LSP T670, LSY T670, LOP T670, LYG T670 LG T671, LOG T671, LSG T671 LB T673, LV T673, LT T673, LW T673 LH T674 LS T676, LA T676, LO T676, LY T676, LB T676, LH T676, LSB T676, LW T676 LB T67C, LV T67C, LT T67C, LS T67K, LO T67K, LY T67K, LW E67C LS E67B, LA E67B, LO E67B, LY E67B, LB E67C, LV E67C, LT E67C LW T67C LS T679, LY T679, LG T679 LS T770, LO T770, LY T770, LG T770, LP T770 LB T773, LV T773, LT T773, LW T773 LH T774 LS E675, LA E675, LY E675, LS T675 LS T776, LA T776, LO T776, LY T776, LB T776 LHGB T686 LT T68C, LB T68C - Hyper Mini TOPLED® LB M676 - Mini TOPLED Santana® LG M470 LS M47K, LO M47K, LY M47K Source: http://www.osram.convergy.de LUXEON: - LUMILED® LXK2-PW12-R00, LXK2-PW12-S00, LXK2-PW14-U00, LXK2-PW14-V00 LXK2-PM12-R00, LXK2-PM12-S00, LXK2-PM14-U00 LXK2-PE12-Q00, LXK2-PE12-R00, LXK2-PE12-S00, LXK2-PE14-T00, LXK2-PE14-U00 LXK2-PB12-K00, LXK2-PB12-L00, LXK2-PB12-M00, LXK2-PB14-N00, LXK2-PB14-P00, LXK2-PB14-Q00 LXK2-PR12-L00, LXK2-PR12-M00, LXK2-PR14-Q00, LXK2-PR14-R00 LXK2-PD12-Q00, LXK2-PD12-R00, LXK2-PD12-S00 LXK2-PH12-R00, LXK2-PH12-S00 LXK2-PL12-P00, LXK2-PL12-Q00, LXK2-PL12-R00 Source: www.luxeon.com KINGBRIGHT: KA-3528ASYC Source: www.kingbright.com
LOGO1 = ohw-logo:OSHW_LOGO_FILL
P8 P9 = con-headers-jp:F-2X23-
Q1 Q4-Q6 = semicon-smd-ipc:NPN-TRANSISTOR_: NPN TRANSISTOR; MPN: AO7400
Q2 Q3 = transistor-power:AON6758
R1-R4 R6 R9 R10 R12 R14 R15 R23 R28-R31 R35-R38 R41 R45-R49 R53-R55 R57 R61 R62 R66 R67 R77 R78 = rcl:R-EU_: RESISTOR, European symbol
R5 R11 R19-R21 R25 R32-R34 = rcl:R-EU_: RESISTOR, European symbol; MPN: RC0402JR-074K7L
R7 R8 R13 R16 R22 R24 R26 R27 R50-R52 R56 R58-R60 R63-R65 R68-R76 R79-R87 = SparkFun-Resistors:RESISTOR: Resistor Basic schematic elements and footprints for 0603, 1206, and PTH resistors.
R17 R18 = rcl:R-EU_: RESISTOR, European symbol; MPN: RC0402FR-074K7L
R39 R40 R43 = rcl:R-EU_: RESISTOR, European symbol; MPN: RC0402FR-0710KL
R42 = rcl:R-EU_: RESISTOR, European symbol; MPN: RMCF0402FT120K
R44 = rcl:R-EU_: RESISTOR, European symbol; MPN: RC1005J393CS
U1 U2 U7 = sn74hc595:SN74AHC595PW: 8 bit shift registers with 3-state output registers; MPN: SN74AHC595PW; OC_FARNELL: 1741463; OC_NEWARK: 50R5930; PACKAGE: TSSOP-16; SUPPLIER: Texas Instruments
U3-U6 = reach_custom:MCP9600
U10 = SparkFun:RT8268; MPN: RT8268GFP
U11 = custom:PCA9685PW: 16-channel, 12-bit PWM Fm+ I2C-bus LED controller; MPN: PCA9685PW; OC_FARNELL: 1854074; OC_NEWARK: 19T6398; PACKAGE: TSSOP-28; SUPPLIER: NXP
U18 = custom:CAT24C256
U$4 = Replicape_B3:CC-BY-SA
X1 X4 X5 X7 X9 X11 = con-molex:22-?-02: CONNECTOR wire to board 2.54 mm (.1 inch) pitch header; MPN: 640455-2; OC_FARNELL: 9731601; OC_NEWARK: unknown
X2 = con-phoenix-508:MSTBA4: PHOENIX; MF: FARNELL; MPN: 1757268; OC_FARNELL: 3705195; OC_NEWARK: 71C4163
X3 X21 = con-phoenix-508:MSTBA2: PHOENIX; MF: FARNELL; MPN: 1757242; OC_FARNELL: 3705171; OC_NEWARK: 71C4161
X6 X8 X14 = con-molex:22-?-04: CONNECTOR wire to board 2.54 mm (.1 inch) pitch header; OC_FARNELL: unknown; OC_NEWARK: unknown

## Net classes
1 power: width 1.27 mm
2 Stepper: width 0.508 mm, clearance 0.305 mm